# Altium project GR_Action.PrjPCB
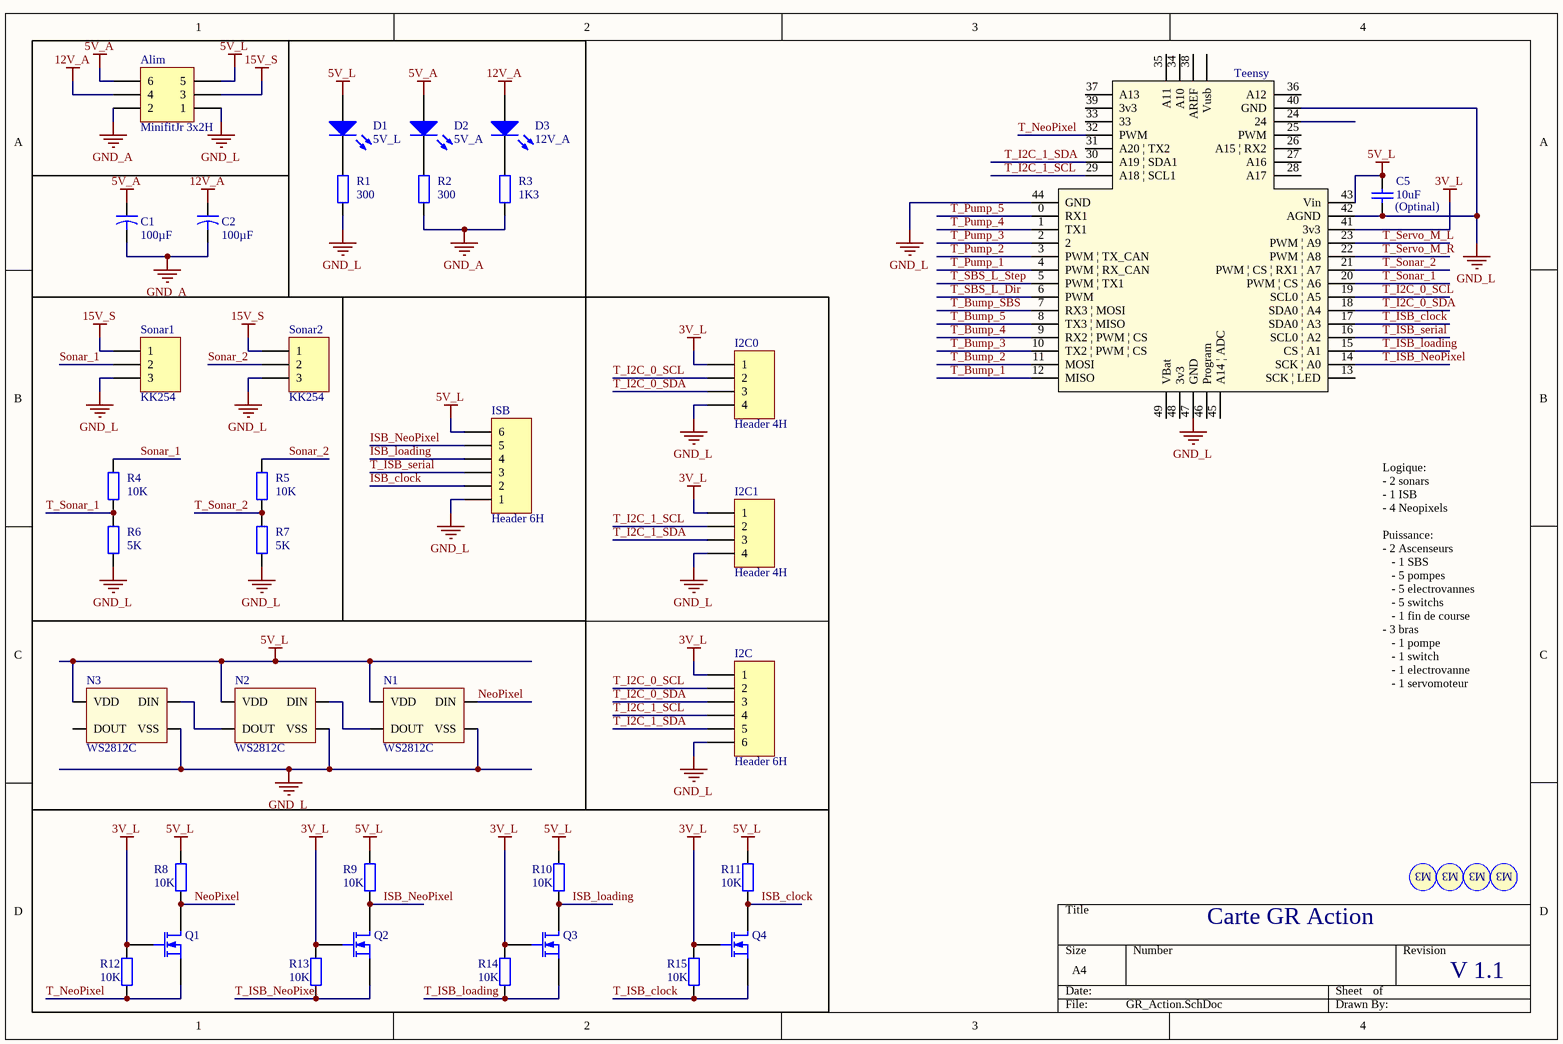
[diagram p0: GR_Action.SchDoc]
2 sheets, 107 parts. Net scope: global (net labels, ports and power ports of the same name join across sheets).
Board file: GR_Action.PcbDoc
Sheets:
  GR_Action.SchDoc
  GR_Action_Ascensseur.SchDoc

## Sheet GR_Action.SchDoc
size A4

### Parts
Alim  MinifitJr 3x2H  [MOLEX_MINIFITJR_3X2]
C1  value 100µF  [Condensateur]  (hidden comment: Cap2)
C2  value 100µF  [Condensateur]  (hidden comment: Cap2)
C5  (Optinal)  value 10uF  [Capacitor 1206]
D1  5V_L  [KP-3216SEC]
D2  5V_A  [KP-3216SEC]
D3  12V_A  [KP-3216SEC]
I2C  Header 6H  [S6B-XH-A]
I2C0  Header 4H  [S4B-XH-A]
I2C1  Header 4H  [S4B-XH-A]
ISB  Header 6H  [S6B-XH-A]
N1  WS2812C  [WS2812C]
N2  WS2812C  [WS2812C]
N3  WS2812C  [WS2812C]
Q1  MOSFET-N  [SOT23_M]  (value not drawn)
Q2  MOSFET-N  [SOT23_M]  (value not drawn)
Q3  MOSFET-N  [SOT23_M]  (value not drawn)
Q4  MOSFET-N  [SOT23_M]  (value not drawn)
R1  value 300  [Resistor 1206]  (hidden comment: Res2)
R2  value 300  [Resistor 1206]  (hidden comment: Res2)
R3  value 1K3  [Resistor 1206]  (hidden comment: Res2)
R4  value 10K  [Resistor 1206]  (hidden comment: Res2)
R5  value 10K  [Resistor 1206]  (hidden comment: Res2)
R6  value 5K  [Resistor 1206]  (hidden comment: Res2)
R7  value 5K  [Resistor 1206]  (hidden comment: Res2)
R8  value 10K  [Resistor 1206]  (hidden comment: Res2)
R9  value 10K  [Resistor 1206]  (hidden comment: Res2)
R10  value 10K  [Resistor 1206]  (hidden comment: Res2)
R11  value 10K  [Resistor 1206]  (hidden comment: Res2)
R12  value 10K  [Resistor 1206]  (hidden comment: Res2)
R13  value 10K  [Resistor 1206]  (hidden comment: Res2)
R14  value 10K  [Resistor 1206]  (hidden comment: Res2)
R15  value 10K  [Resistor 1206]  (hidden comment: Res2)
S1  Screw M3  [Screw M3]  (value not drawn)
S2  Screw M3  [Screw M3]  (value not drawn)
S3  Screw M3  [Screw M3]  (value not drawn)
S4  Screw M3  [Screw M3]  (value not drawn)
Sonar1  KK254  [MOLEX KK254 3X1H M]
Sonar2  KK254  [MOLEX KK254 3X1H M]
Teensy  Teensy 3.2  [teensy]  (value not drawn)

### Nets
3V_L: I2C.1 I2C0.1 I2C1.1 Q1.2(G) Q2.2(G) Q3.2(G) Q4.2(G) R12.2 R13.2 R14.2 R15.2 Teensy.41(3v3)
5V_A: Alim.6 C1.1 D2.1(A)
5V_L: Alim.5 C5.2 D1.1(A) ISB.6 N1.1(VDD) N2.1(VDD) N3.1(VDD) R8.2 R9.2 R10.2 R11.2 Teensy.43(Vin)
12V_A: Alim.4 C2.1 D3.1(A)
15V_S: Alim.3 Sonar1.1 Sonar2.1
GND_A: Alim.2 C1.2 C2.2 R2.2 R3.2
GND_L: Alim.1 C5.1 I2C.6 I2C0.4 I2C1.4 ISB.1 N1.3(VSS) N2.3(VSS) N3.3(VSS) R1.1 R6.2 R7.2 Sonar1.3 Sonar2.3 Teensy.40(GND) Teensy.42(AGND) Teensy.44(GND) Teensy.47(GND)
ISB_clock: ISB.2 Q4.1(D) R11.1
ISB_loading: ISB.4 Q3.1(D) R10.1
ISB_NeoPixel: ISB.5 Q2.1(D) R9.1
NeoPixel: N1.4(DIN) Q1.1(D) R8.1
Sonar_1: R4.1 Sonar1.2
Sonar_2: R5.1 Sonar2.2
T_Bump_1: Teensy.12(MISO)  [project net Bump_1]
T_Bump_2: Teensy.11(MOSI)  [project net Bump_2]
T_Bump_3: Teensy.10(TX2_|_PWM_|_CS)  [project net Bump_3]
T_Bump_4: Teensy.9(RX2_|_PWM_|_CS)  [project net Bump_4]
T_Bump_5: Teensy.8(TX3_|_MISO)  [project net Bump_5]
T_Bump_SBS: Teensy.7(RX3_|_MOSI)
T_I2C_0_SCL: I2C.2 I2C0.2 Teensy.19(SCL0_|_A5)
T_I2C_0_SDA: I2C.3 I2C0.3 Teensy.18(SDA0_|_A4)
T_I2C_1_SCL: I2C.4 I2C1.2 Teensy.29(A18_|_SCL1)
T_I2C_1_SDA: I2C.5 I2C1.3 Teensy.30(A19_|_SDA1)
T_ISB_clock: Q4.3(S) R15.1 Teensy.17(SDA0_|_A3)
T_ISB_loading: Q3.3(S) R14.1 Teensy.15(CS_|_A1)
T_ISB_NeoPixel: Q2.3(S) R13.1 Teensy.14(SCK_|_A0)
T_ISB_serial: ISB.3 Teensy.16(SCL0_|_A2)
T_NeoPixel: Q1.3(S) R12.1 Teensy.32(PWM)
T_Pump_1: Teensy.4(PWM_|_RX_CAN)
T_Pump_2: Teensy.3(PWM_|_TX_CAN)
T_Pump_3: Teensy.2
T_Pump_4: Teensy.1(TX1)
T_Pump_5: Teensy.0(RX1)
T_SBS_L_Dir: Teensy.6(PWM)
T_SBS_L_Step: Teensy.5(PWM_|_TX1)
T_Servo_M_L: Teensy.23(PWM_|_A9)
T_Servo_M_R: Teensy.22(PWM_|_A8)
T_Sonar_1: R4.2 R6.1 Teensy.20(PWM_|_CS_|_A6)
T_Sonar_2: R5.2 R7.1 Teensy.21(PWM_|_CS_|_RX1_|_A7)
NetD1_2: D1.2(K) R1.2
NetD2_2: D2.2(K) R2.1
NetD3_2: D3.2(K) R3.1
NetN1_2: N1.2(DOUT) N2.4(DIN)
NetN2_2: N2.2(DOUT) N3.4(DIN)

Not connected (* = marked no-connect by the designer): N3 2(DOUT); Teensy 13(SCK_|_LED) 24 25(PWM) 26(A15_|_RX2) 27(A16) 28(A17) 31(A20_|_TX2) 33 34(A10) 35(A11) 36(A12) 37(A13) 38(AREF) 39(3v3) 45(A14_|_ADC) 46(Program) 48(3v3) 49(VBat) 50(Vusb)

### Notes on the sheet
- Logique:
  - 2 sonars
  - 1 ISB
  - 4 Neopixels
  Puissance:
  - 2 Ascenseurs
  - 1 SBS
  - 5 pompes
  - 5 electrovannes
  - 5 switchs
  - 1 fin de course
  - 3 bras
  - 1 pompe
  - 1 switch
  - 1 electrovanne
  - 1 servomoteur
- Carte GR Action
- V 1.1
- (in symbol Screw M3) M3

### Library data of the parts
Alim = Header 3X2H: Header, 3-Pin, Dual row, Right Angle; LatestRevisionDate: 17-Jul-2002; LatestRevisionNote: Re-released for DXP Platform.; Publisher: Altium Limited
C1 C2 = Cap2: Capacitor; Published: 23-Sep-2002; PackageReference: CAPR5-4X5; Publisher: Altium Limited; PackageDescription: Capacitor; 2 Leads
C5 = Cap: Capacitor; Published: 8-Jun-2000; LatestRevisionDate: 17-Jul-2002; LatestRevisionNote: Re-released for DXP Platform.; PackageReference: RAD-0.3; Publisher: Altium Limited; PackageDescription: Radial Cap, Thru-Hole; 2 Leads; 0.3 in Pin Spacing
D1-D3 = LED2: Typical RED, GREEN, YELLOW, AMBER GaAs LED; Published: 8-Jun-2000; LatestRevisionDate: 17-Jul-2002; LatestRevisionNote: Re-released for DXP Platform.; PackageVersion: Feb-2002; PackageReference: 3.2X1.6X1.1; Publisher: Altium Limited; PackageDescription: SM LED; 2 Flat Leads
I2C ISB = Header 6H: Header, 6-Pin, Right Angle; LatestRevisionDate: 17-Jul-2002; LatestRevisionNote: Re-released for DXP Platform.; Publisher: Altium Limited
I2C0 I2C1 = Header 4H: Header, 4-Pin, Right Angle; LatestRevisionDate: 17-Jul-2002; LatestRevisionNote: Re-released for DXP Platform.; Publisher: Altium Limited
N1-N3 = WS2812C: Intelligent control LED
Q1-Q4 = MOSFET-N: N-Channel MOSFET; pin to pad: 2>3 3>2; Published: 8-Jun-2000; LatestRevisionDate: 17-Jul-2002; LatestRevisionNote: Re-released for DXP Platform.; PackageVersion: 1995/1996; PackageReference: E3; Publisher: Altium Limited; PackageDescription: TO, Flat Index; 3 In-Line, Axial Leads; Body Dia. 4.6mm; Lead Dia. 0.5 mm (max)
R1-R15 = Res2: Resistor; Published: 8-Jun-2000; LatestRevisionDate: 17-Jul-2002; LatestRevisionNote: Re-released for DXP Platform.; PackageReference: AXIAL-0.4; Publisher: Altium Limited; PackageDescription: Axial Device, Thru-Hole; 2 Leads; 0.4 in Pin Spacing
Sonar1 Sonar2 = Header 3H: Header, 3-Pin, Right Angle; LatestRevisionDate: 17-Jul-2002; LatestRevisionNote: Re-released for DXP Platform.; Publisher: Altium Limited
Teensy = teensy3.2

## Sheet GR_Action_Ascensseur.SchDoc
size A4
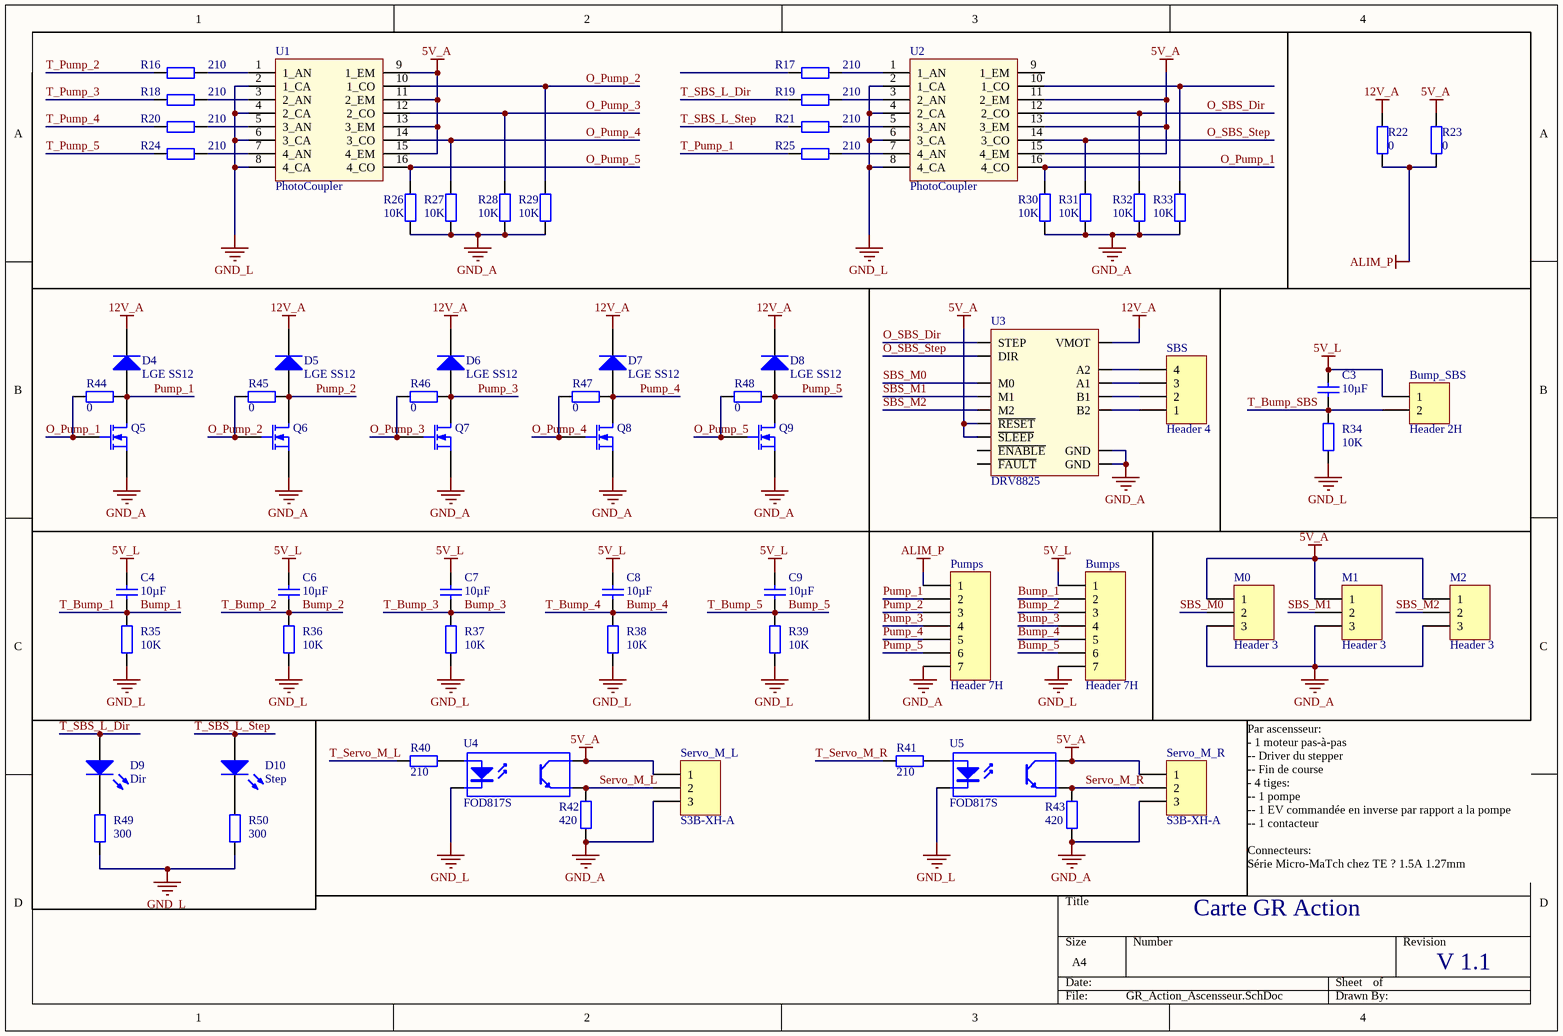
[diagram p1: GR_Action_Ascensseur.SchDoc]

### Parts
Bump_SBS  Header 2H  [S2B-XH-A]
Bumps  Header 7H  [S7B-XH-A]
C3  value 10µF  [Capacitor 1206]
C4  value 10µF  [Capacitor 1206]
C6  value 10µF  [Capacitor 1206]
C7  value 10µF  [Capacitor 1206]
C8  value 10µF  [Capacitor 1206]
C9  value 10µF  [Capacitor 1206]
D4  LGE SS12  [SMB]
D5  LGE SS12  [SMB]
D6  LGE SS12  [SMB]
D7  LGE SS12  [SMB]
D8  LGE SS12  [SMB]
D9  Dir  [KP-3216SEC]
D10  Step  [KP-3216SEC]
M0  Header 3  [HDR1X3]
M1  Header 3  [HDR1X3]
M2  Header 3  [HDR1X3]
Pumps  Header 7H  [S7B-XH-A]
Q5  MOSFET-N  [SOT23_M]  (value not drawn)
Q6  MOSFET-N  [SOT23_M]  (value not drawn)
Q7  MOSFET-N  [SOT23_M]  (value not drawn)
Q8  MOSFET-N  [SOT23_M]  (value not drawn)
Q9  MOSFET-N  [SOT23_M]  (value not drawn)
R16  value 210  [Resistor 1206]  (hidden comment: Res2)
R17  value 210  [Resistor 1206]  (hidden comment: Res2)
R18  value 210  [Resistor 1206]  (hidden comment: Res2)
R19  value 210  [Resistor 1206]  (hidden comment: Res2)
R20  value 210  [Resistor 1206]  (hidden comment: Res2)
R21  value 210  [Resistor 1206]  (hidden comment: Res2)
R22  value 0  [Resistor 1206]  (hidden comment: Res2)
R23  value 0  [Resistor 1206]  (hidden comment: Res2)
R24  value 210  [Resistor 1206]  (hidden comment: Res2)
R25  value 210  [Resistor 1206]  (hidden comment: Res2)
R26  value 10K  [Resistor 1206]  (hidden comment: Res2)
R27  value 10K  [Resistor 1206]  (hidden comment: Res2)
R28  value 10K  [Resistor 1206]  (hidden comment: Res2)
R29  value 10K  [Resistor 1206]  (hidden comment: Res2)
R30  value 10K  [Resistor 1206]  (hidden comment: Res2)
R31  value 10K  [Resistor 1206]  (hidden comment: Res2)
R32  value 10K  [Resistor 1206]  (hidden comment: Res2)
R33  value 10K  [Resistor 1206]  (hidden comment: Res2)
R34  value 10K  [Resistor 1206]  (hidden comment: Res2)
R35  value 10K  [Resistor 1206]  (hidden comment: Res2)
R36  value 10K  [Resistor 1206]  (hidden comment: Res2)
R37  value 10K  [Resistor 1206]  (hidden comment: Res2)
R38  value 10K  [Resistor 1206]  (hidden comment: Res2)
R39  value 10K  [Resistor 1206]  (hidden comment: Res2)
R40  value 210  [Resistor 1206]  (hidden comment: Res2)
R41  value 210  [Resistor 1206]  (hidden comment: Res2)
R42  value 420  [Resistor 1206]  (hidden comment: Res2)
R43  value 420  [Resistor 1206]  (hidden comment: Res2)
R44  value 0  [Resistor 1206]  (hidden comment: Res2)
R45  value 0  [Resistor 1206]  (hidden comment: Res2)
R46  value 0  [Resistor 1206]  (hidden comment: Res2)
R47  value 0  [Resistor 1206]  (hidden comment: Res2)
R48  value 0  [Resistor 1206]  (hidden comment: Res2)
R49  value 300  [Resistor 1206]  (hidden comment: Res2)
R50  value 300  [Resistor 1206]  (hidden comment: Res2)
SBS  Header 4  [S4B-XH-A]
Servo_M_L  S3B-XH-A  [S3B-XH-A]
Servo_M_R  S3B-XH-A  [S3B-XH-A]
U1  PhotoCoupler  [LTV-247]
U2  PhotoCoupler  [LTV-247]
U3  DRV8825  [DRV8825]
U4  FOD817S  [SOP254P1016X385-4N]
U5  FOD817S  [SOP254P1016X385-4N]

### Nets
5V_A: M0.1 M1.1 M2.1 R23.1 Servo_M_L.1 Servo_M_R.1 U1.9(1_EM) U1.11(2_EM) U1.13(3_EM) U1.15(4_EM) U2.11(2_EM) U2.13(3_EM) U2.15(4_EM) U3.5(~{RESET}) U3.6(~{SLEEP}) U4.4(C) U5.4(C)
5V_L: Bump_SBS.1 Bumps.1 C3.2 C4.2 C6.2 C7.2 C8.2 C9.2
12V_A: D4.2(K) D5.2(K) D6.2(K) D7.2(K) D8.2(K) R22.1 U3.16(VMOT)
ALIM_P: Pumps.1 R22.2 R23.2
GND_A: M0.3 M1.3 M2.3 Pumps.7 Q5.3(S) Q6.3(S) Q7.3(S) Q8.3(S) Q9.3(S) R26.1 R27.1 R28.1 R29.1 R30.1 R31.1 R32.1 R33.1 R42.1 R43.1 Servo_M_L.3 Servo_M_R.3 U3.9(GND) U3.15(GND)
GND_L: Bumps.7 R34.1 R35.1 R36.1 R37.1 R38.1 R39.1 R49.1 R50.1 U1.2(1_CA) U1.4(2_CA) U1.6(3_CA) U1.8(4_CA) U2.2(1_CA) U2.4(2_CA) U2.6(3_CA) U2.8(4_CA) U4.2(K) U5.2(K)
Bump_1: Bumps.2 C4.1 R35.2  [also labelled T_Bump_1]
Bump_2: Bumps.3 C6.1 R36.2  [also labelled T_Bump_2]
Bump_3: Bumps.4 C7.1 R37.2  [also labelled T_Bump_3]
Bump_4: Bumps.5 C8.1 R38.2  [also labelled T_Bump_4]
Bump_5: Bumps.6 C9.1 R39.2  [also labelled T_Bump_5]
O_Pump_1: Q5.2(G) R30.2 R44.1 U2.16(4_CO)
O_Pump_2: Q6.2(G) R29.2 R45.1 U1.10(1_CO)
O_Pump_3: Q7.2(G) R28.2 R46.1 U1.12(2_CO)
O_Pump_4: Q8.2(G) R27.2 R47.1 U1.14(3_CO)
O_Pump_5: Q9.2(G) R26.2 R48.1 U1.16(4_CO)
O_SBS_Dir: R32.2 U2.12(2_CO) U3.7(STEP)
O_SBS_Step: R31.2 U2.14(3_CO) U3.8(DIR)
Pump_1: D4.1(A) Pumps.2 Q5.1(D) R44.2
Pump_2: D5.1(A) Pumps.3 Q6.1(D) R45.2
Pump_3: D6.1(A) Pumps.4 Q7.1(D) R46.2
Pump_4: D7.1(A) Pumps.5 Q8.1(D) R47.2
Pump_5: D8.1(A) Pumps.6 Q9.1(D) R48.2
SBS_M0: M0.2 U3.2(M0)
SBS_M1: M1.2 U3.3(M1)
SBS_M2: M2.2 U3.4(M2)
Servo_M_L: R42.2 Servo_M_L.2 U4.3(E)
Servo_M_R: R43.2 Servo_M_R.2 U5.3(E)
T_Bump_SBS: Bump_SBS.2 C3.1 R34.2
T_Pump_1: R25.2
T_Pump_2: R16.2
T_Pump_3: R18.2
T_Pump_4: R20.2
T_Pump_5: R24.2
T_SBS_L_Dir: D9.1(A) R19.2
T_SBS_L_Step: D10.1(A) R21.2
T_Servo_M_L: R40.2
T_Servo_M_R: R41.2
NetD9_2: D9.2(K) R49.2
NetD10_2: D10.2(K) R50.2
NetR16_1: R16.1 U1.1(1_AN)
NetR17_1: R17.1 U2.1(1_AN)
NetR18_1: R18.1 U1.3(2_AN)
NetR19_1: R19.1 U2.3(2_AN)
NetR20_1: R20.1 U1.5(3_AN)
NetR21_1: R21.1 U2.5(3_AN)
NetR24_1: R24.1 U1.7(4_AN)
NetR25_1: R25.1 U2.7(4_AN)
NetR33_2: R33.2 U2.10(1_CO)
NetR40_1: R40.1 U4.1(A)
NetR41_1: R41.1 U5.1(A)
NetSBS_1: SBS.1 U3.14(B2)
NetSBS_2: SBS.2 U3.13(B1)
NetSBS_3: SBS.3 U3.12(A1)
NetSBS_4: SBS.4 U3.11(A2)

Not connected (* = marked no-connect by the designer): R17 2; U2 9(1_EM); U3 1(~{ENABLE}) 10(~{FAULT})

### Notes on the sheet
- Carte GR Action
- Par ascensseur:
  - 1 moteur pas-à-pas
  -- Driver du stepper
  -- Fin de course
  - 4 tiges:
  -- 1 pompe
  -- 1 EV commandée en inverse par rapport a la pompe
  -- 1 contacteur
  Connecteurs:
  Série Micro-MaTch chez TE ? 1.5A 1.27mm
- V 1.1

### Library data of the parts
Bump_SBS = Header 2H: Header, 2-Pin, Right Angle; LatestRevisionDate: 17-Jul-2002; LatestRevisionNote: Re-released for DXP Platform.; Publisher: Altium Limited
Bumps Pumps = Header 7H: Header, 7-Pin, Right Angle; LatestRevisionDate: 17-Jul-2002; LatestRevisionNote: Re-released for DXP Platform.; Publisher: Altium Limited
C3 C4 C6-C9 = Cap: Capacitor; Published: 8-Jun-2000; LatestRevisionDate: 17-Jul-2002; LatestRevisionNote: Re-released for DXP Platform.; PackageReference: RAD-0.3; Publisher: Altium Limited; PackageDescription: Radial Cap, Thru-Hole; 2 Leads; 0.3 in Pin Spacing
D4-D8 = Diode: Default Diode; Published: 8-Jun-2000; LatestRevisionDate: 17-Jul-2002; LatestRevisionNote: Re-released for DXP Platform.; PackageVersion: Sep-1996; PackageReference: SMC; Publisher: Altium Limited; PackageDescription: DO-214-AB/SMC; 2 C-Bend Leads; Body 7.9 x 5.9 mm, inc. leads (LxW); Code_JEDEC: DO-214-AB
D9 D10 = LED2: as D1 on sheet GR_Action; Published: 8-Jun-2000; LatestRevisionDate: 17-Jul-2002; LatestRevisionNote: Re-released for DXP Platform.; PackageVersion: Feb-2002; PackageReference: 3.2X1.6X1.1; Publisher: Altium Limited; PackageDescription: SM LED; 2 Flat Leads
M0-M2 = Header 3: Header, 3-Pin; LatestRevisionDate: 17-Jul-2002; LatestRevisionNote: Re-released for DXP Platform.; Publisher: Altium Limited
Q5-Q9 = MOSFET-N: N-Channel MOSFET; pin to pad: 2>3 3>2; Published: 8-Jun-2000; LatestRevisionDate: 17-Jul-2002; LatestRevisionNote: Re-released for DXP Platform.; PackageVersion: 1995/1996; PackageReference: E3; Publisher: Altium Limited; PackageDescription: TO, Flat Index; 3 In-Line, Axial Leads; Body Dia. 4.6mm; Lead Dia. 0.5 mm (max)
R16-R50 = Res2: Resistor; Published: 8-Jun-2000; LatestRevisionDate: 17-Jul-2002; LatestRevisionNote: Re-released for DXP Platform.; PackageReference: AXIAL-0.4; Publisher: Altium Limited; PackageDescription: Axial Device, Thru-Hole; 2 Leads; 0.4 in Pin Spacing
SBS = Header 4: Header, 4-Pin; LatestRevisionDate: 17-Jul-2002; LatestRevisionNote: Re-released for DXP Platform.; Publisher: Altium Limited
Servo_M_L Servo_M_R = Header 3H: Header, 3-Pin, Right Angle; LatestRevisionDate: 17-Jul-2002; LatestRevisionNote: Re-released for DXP Platform.; Publisher: Altium Limited
U1 U2 = LTV-247: Integrated Circuit; Manufacturer_Name: Lite-On; Datasheet Link: http://optoelectronics.liteon.com/upload/download/DS70-2009-0014/LTV-2X7%20sereis%20Mar17.PDF; Manufacturer_Part_Number: LTV-247; Mouser Part Number: 859-LTV-247; Mouser Price/Stock: https://www.mouser.co.uk/ProductDetail/Lite-On/LTV-247/?qs=9ayhpukWNmvWpoxQBzWkFA%3D%3D; Arrow Part Number: LTV-247; Arrow Price/Stock: https://www.arrow.com/en/products/ltv-247/lite-on-technology
U3 = DRV8825: Stepper Driver Module
U4 U5 = Optoisolator1: 4-Pin Phototransistor Optocoupler; Published: 24-Mar-1999; LatestRevisionDate: 04-Mar-2005; LatestRevisionNote: Sch pins 3 & 4 Swapped.; DatasheetVersion: Nov-2003; PackageReference: DIP-4; Publisher: Altium Limited

## Nets that join several sheets
5V_A: GR_Action (Alim.6 C1.1 D2.1), GR_Action_Ascensseur (17 pins)
5V_L: GR_Action (12 pins), GR_Action_Ascensseur (8 pins)
12V_A: GR_Action (Alim.4 C2.1 D3.1), GR_Action_Ascensseur (7 pins)
GND_A: GR_Action (5 pins), GR_Action_Ascensseur (23 pins)
GND_L: GR_Action (18 pins), GR_Action_Ascensseur (19 pins)
Bump_1: GR_Action (Teensy.12), GR_Action_Ascensseur (Bumps.2 C4.1 R35.2)
Bump_2: GR_Action (Teensy.11), GR_Action_Ascensseur (Bumps.3 C6.1 R36.2)
Bump_3: GR_Action (Teensy.10), GR_Action_Ascensseur (Bumps.4 C7.1 R37.2)
Bump_4: GR_Action (Teensy.9), GR_Action_Ascensseur (Bumps.5 C8.1 R38.2)
Bump_5: GR_Action (Teensy.8), GR_Action_Ascensseur (Bumps.6 C9.1 R39.2)
T_Bump_SBS: GR_Action (Teensy.7), GR_Action_Ascensseur (Bump_SBS.2 C3.1 R34.2)
T_Pump_1: GR_Action (Teensy.4), GR_Action_Ascensseur (R25.2)
T_Pump_2: GR_Action (Teensy.3), GR_Action_Ascensseur (R16.2)
T_Pump_3: GR_Action (Teensy.2), GR_Action_Ascensseur (R18.2)
T_Pump_4: GR_Action (Teensy.1), GR_Action_Ascensseur (R20.2)
T_Pump_5: GR_Action (Teensy.0), GR_Action_Ascensseur (R24.2)
T_SBS_L_Dir: GR_Action (Teensy.6), GR_Action_Ascensseur (D9.1 R19.2)
T_SBS_L_Step: GR_Action (Teensy.5), GR_Action_Ascensseur (D10.1 R21.2)
T_Servo_M_L: GR_Action (Teensy.23), GR_Action_Ascensseur (R40.2)
T_Servo_M_R: GR_Action (Teensy.22), GR_Action_Ascensseur (R41.2)